# EAGLE design encoder (EAGLE 6.4)
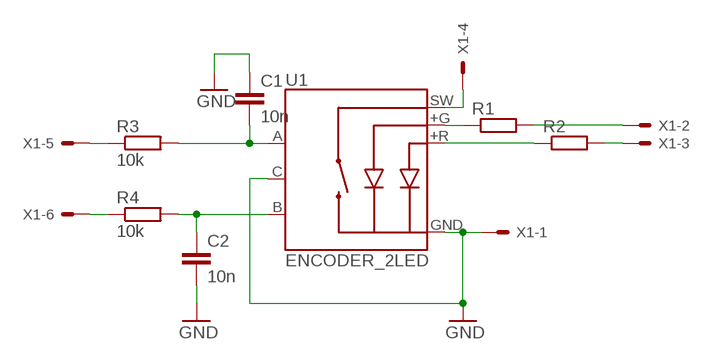
[diagram p0: schematic, sheet 1]

## Parts
C1  10n  C-EU025-024X044  [C025-024X044]
C2  10n  C-EU025-024X044  [C025-024X044]
R1  R-EU_R0603  [R0603]
R2  R-EU_R0603  [R0603]
R3  10k  R-EU_R0603  [R0603]
R4  10k  R-EU_R0603  [R0603]
U1  ENCODER_2LED  [ENCODER_LED_2]
X1  22-23-2061  [22-23-2061]

## Nets
GND: C1.1 C2.2 U1.C U1.GND(-) X1.1
N$1: R1.2 X1.2
N$2: R2.2 X1.3
N$3: R1.1 U1.+G
N$4: U1.SW X1.4
N$5: C1.2 R3.2 U1.A
N$6: C2.1 R4.2 U1.B
N$7: R2.1 U1.+R
N$8: R4.1 X1.6
N$9: R3.1 X1.5

## Library data of the parts
C1 C2 = rcl:C-EU: CAPACITOR, European symbol
R1-R4 = rcl:R-EU_: RESISTOR, European symbol
U1 = SparkFun:ENCODER_2LED: Illuminated Rotary Encoder w/ 2 LEDs
X1 = con-molex:22-23-2061: .100" (2.54mm) Center Header - 6 Pin; MF: MOLEX; MPN: 22-23-2061; OC_FARNELL: 1462922; OC_NEWARK: 27C1933

## Board
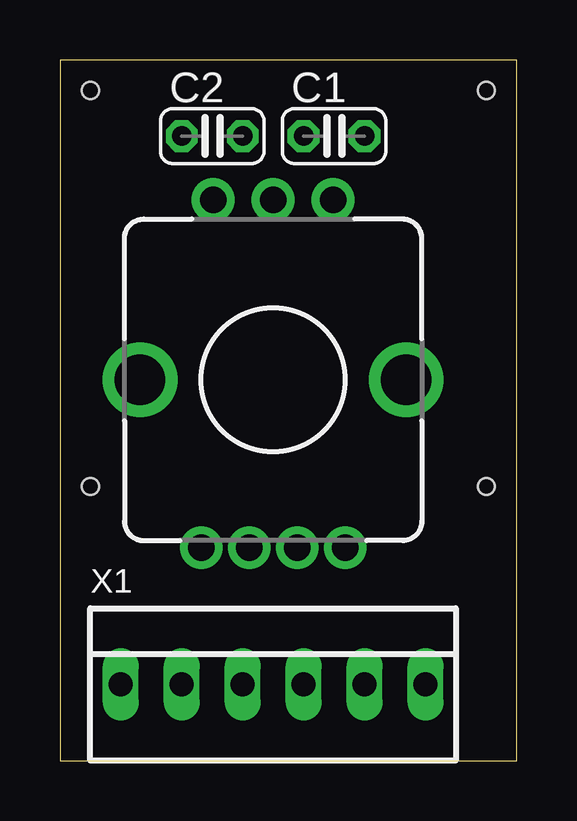
[diagram p1: board, top side]
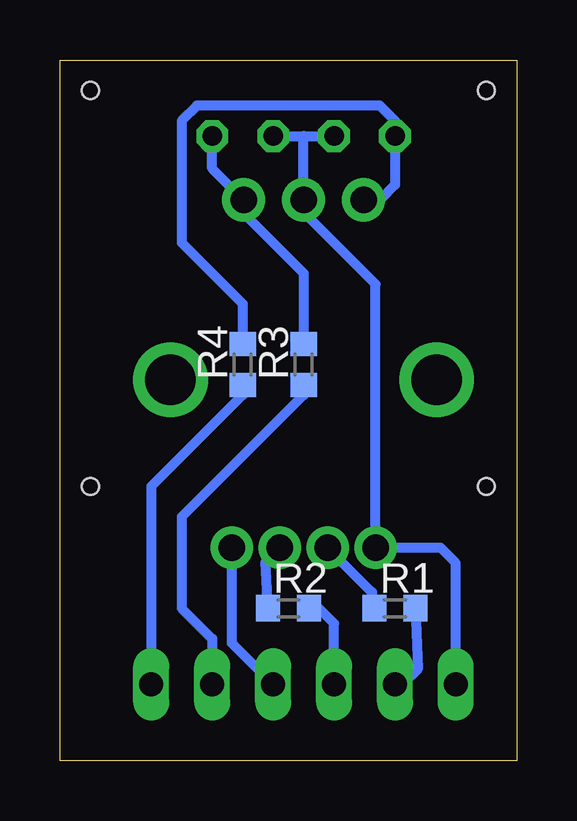
[diagram p2: board, bottom side, seen from below]

Size 19.05 x 29.21 mm. Coordinates in mm from the lower left corner, seen from the top.
Outline: 0,0 19.05,0 19.05,29.21 0,29.21 0,0
Copper layers (1*16): Top 0.035mm / dielectric 1.5mm / Bottom 0.035mm
Design rules "default": minimum track width 10mil, minimum drill 24mil, track to track 8mil, track to pad 8mil, pad to pad 8mil, via to via 8mil, smd to smd 8mil, copper to edge 40mil, drill to drill 8mil, minimum pad ring 10mil, minimum via ring 8mil, stop-mask expansion 4mil, vias tented up to drill 0mil, thermal gap 10mil
Holes 0.7 mm at 1.27,27.94 17.78,27.94 1.27,11.43 17.78,11.43

### Footprints (pad centres in the part's own frame; a part is rotated, then mirrored left to right if it is on the bottom)
C025-024X044 = drill 0.813 octagon: 1 -1.27,0; 2 1.27,0
R0603 = smd 1 x 1.1: 1 -0.85,0; 2 0.85,0
ENCODER_LED_2 = drill 1.1 pad 1.778: +G 1,7; +R -1,7; GND 3,7; SW -3,7 | drill 1.1 pad 1.8: A -2.5,-7.5; B 2.5,-7.5; C 0,-7.5 | drill 2.1: P$1 -5.55,0; P$2 5.55,0
22-23-2061 = drill 1 long: 1 -6.35,0; 2 -3.81,0; 3 -1.27,0; 4 1.27,0; 5 3.81,0; 6 6.35,0

### Placement (x,y rotation side)
C1  11.43,26.04 0 top
C2  6.35,26.04 0 top
R1  5.08,6.35 0 bottom
R2  9.53,6.35 0 bottom
R3  8.89,16.51 90 bottom
R4  11.43,16.51 90 bottom
U1  8.89,15.88 180 top
X1  8.89,3.17 0 top

### Tracks (layer width: path | path; a pad name or v marks a point on that pad's centre or on a via)
GND
  Bottom 0.406: C1.1 8.89,26.04 | 8.89,26.04 C2.2 | 8.89,26.04 U1.C 8.89,22.86 5.89,19.86 U1.GND 3.17,8.88 2.54,8.24 X1.1
N$1
  Bottom 0.406: R1.2 4.13,3.81 4.76,3.17 X1.2
N$2
  Bottom 0.406: X1.3 7.62,5.71 8.26,6.35 R2.2
N$3
  Bottom 0.406: R1.1 6.03,7.01 U1.+G
N$4
  Bottom 0.406: U1.SW 11.89,4.91 X1.4
N$5
  Bottom 0.406: C1.2 12.7,24.68 U1.A 11.39,22.82 8.89,20.32 R3.2
N$6
  Bottom 0.406: R4.2 11.43,19.05 13.97,21.59 13.97,26.67 13.34,27.3 5.71,27.3 5.08,26.67 C2.1 5.08,24.01 5.71,23.38 U1.B
N$7
  Bottom 0.406: R2.1 10.47,8.29 U1.+R
N$8
  Bottom 0.406: R4.1 11.43,15.24 15.24,11.43 X1.6
N$9
  Bottom 0.406: R3.1 8.89,15.24 13.97,10.16 13.97,6.35 12.7,5.08 X1.5